# EAGLE design tiny412 (EAGLE 7.1.0)
DATABASE: ./../../../EAGLE/PARTSDB.TXT
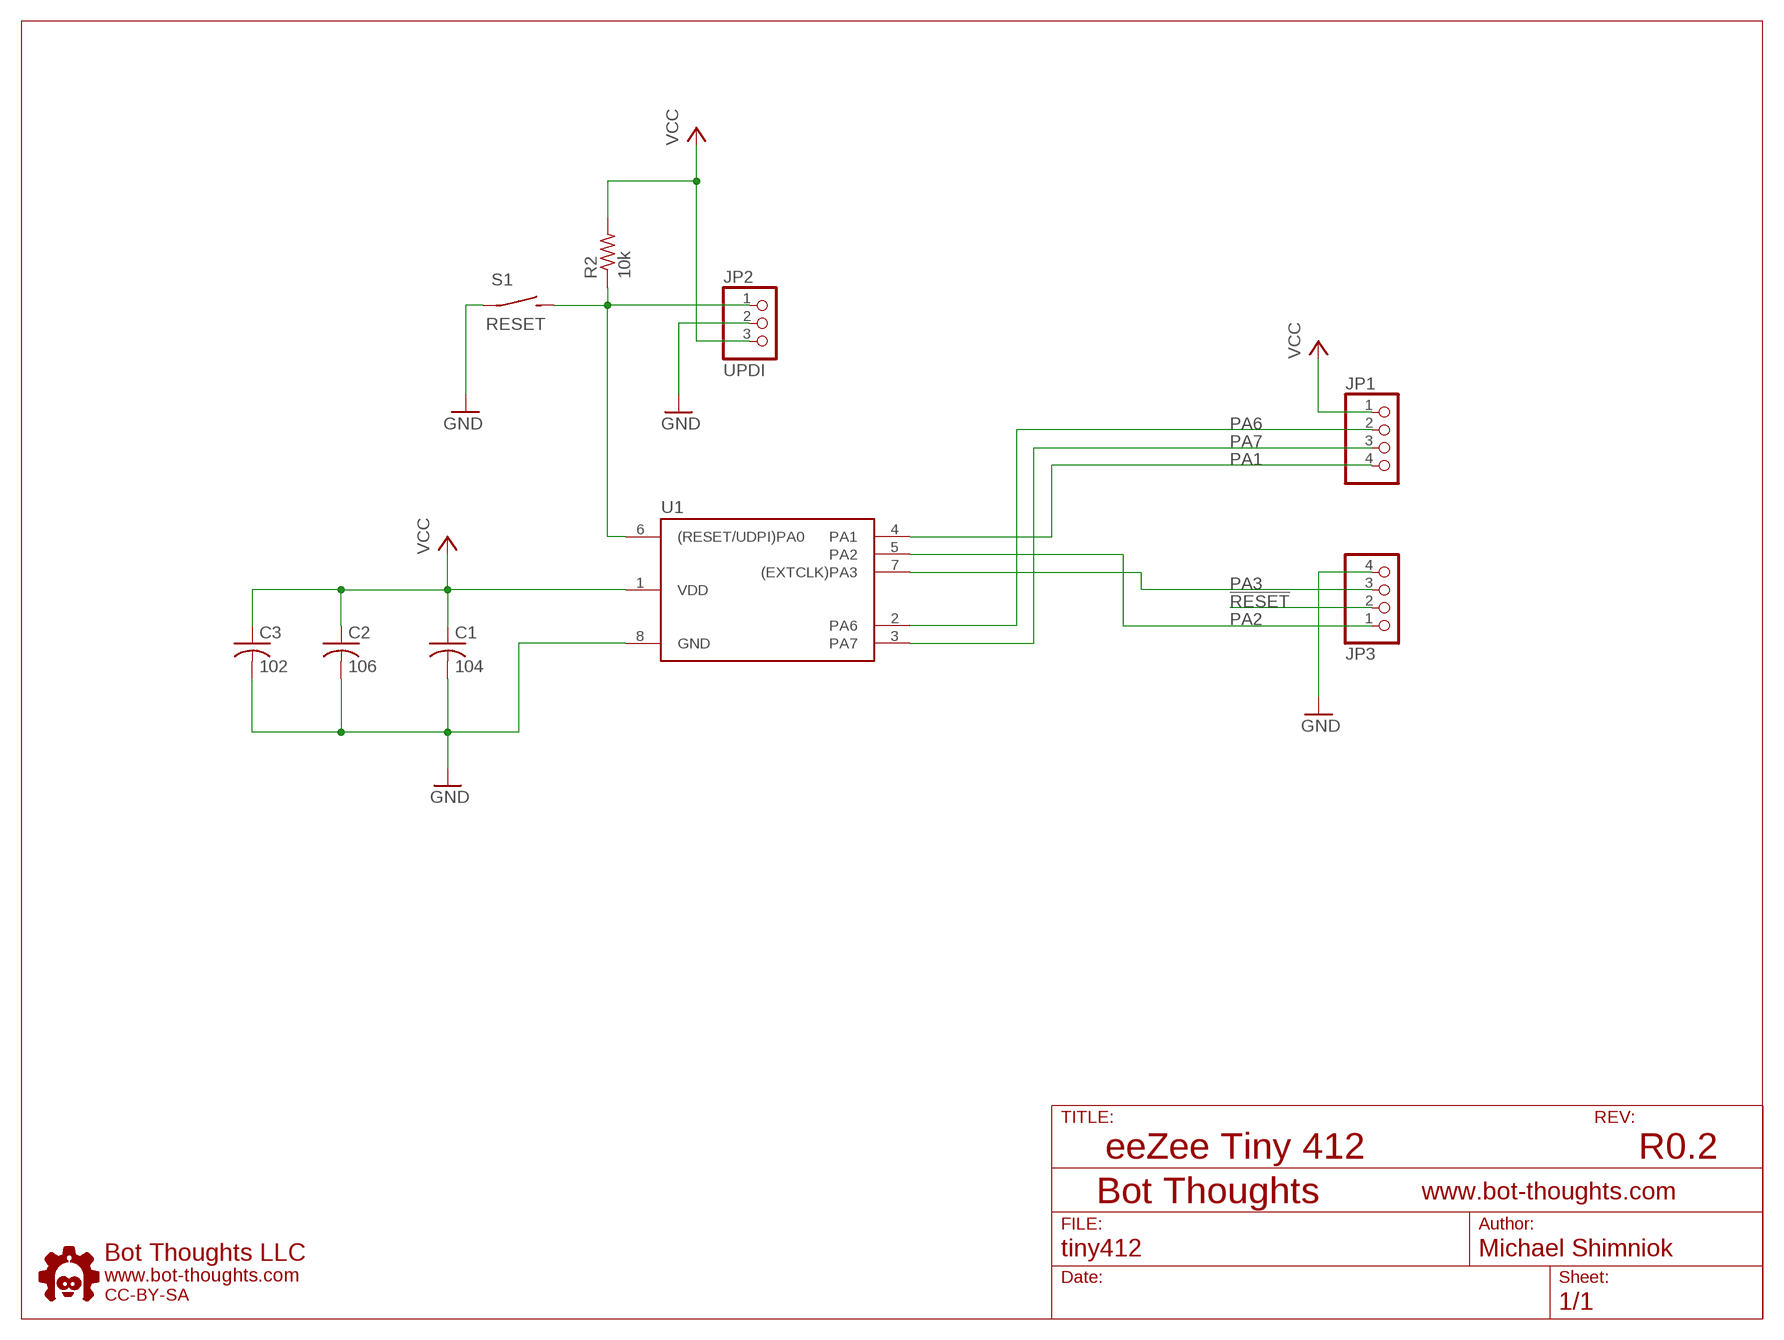
[diagram p0: schematic, sheet 1]

## Parts
C1  104  C-USC0603  [C0603]
C2  106  C-0603  [0603]
C3  102  C-USC0603  [C0603]
JP1  PINHD-1X04_2.54-S  [1X04-S]
JP2  UPDI  PINHD-1X03_2.54-S  [1X03-S]
JP3  PINHD-1X04_2.54-S  [1X04-S]
R2  10k  R-US_R0603  [R0603]
S1  RESET  SPST_3X4X2  [3X4X2TACT]
U1  ATTINY212/412  [SOIC8N]
U$1  BTLOGO-LOGO-MD  [BTLOGOM]

## Nets
!RESET: JP2.1 JP3.2 R2.1 S1.P$2(S) U1.6((RESET/UDPI)PA0)
GND: C1.2 C2.2(-) C3.2 JP2.2 JP3.4 S1.P$1(P) U1.8(GND)
PA1: JP1.4 U1.4(PA1)
PA2: JP3.1 U1.5(PA2)
PA3: JP3.3 U1.7((EXTCLK)PA3)
PA6: JP1.2 U1.2(PA6)
PA7: JP1.3 U1.3(PA7)
VCC: C1.1 C2.1(+) C3.1 JP1.1 JP2.3 R2.2 U1.1(VDD)

## Notes on the sheet
- eeZee Tiny 412 | R0.2

## Library data of the parts
C1 C3 = rcl:C-US: CAPACITOR, American symbol; BOM: EXCLUDE; PARTNO: 0603YC104KAT2A
C2 = bt_rcl:C: Capacitor, non-polarized, American symbol; BOM: EXCLUDE; PARTNO: MCTT21X106M6R3CT
JP1 JP3 = pinhead-2:PINHD-1X04: PIN HEADER
JP2 = pinhead-2:PINHD-1X03: PIN HEADER
R2 = rcl:R-US_: RESISTOR, American symbol; PARTNO: ERJ-3GEYJ103V
S1 = bt_electromech:SPST: SPST SWITCH
U1 = bt_avr:ATTINY212/412: ATtiny412/212 The ATtiny212/412 are members of the tinyAVR ® 1-series of microcontrollers, using the AVR ® processor with hardware multiplier, running at up to 20 MHz, with 2/4 KB Flash, 128/256 bytes of SRAM, and 64/128 bytes of EEPROM in an 8-pin package. The tinyAVR ® 1-series uses the latest technologies with a flexible, low-power architecture including Event System and SleepWalking, accurate analog features, and Core Independent Peripherals. ATtiny212-412-DataSheet.pdf <https://ww1.microchip.com/downloads/en/DeviceDoc/ATtiny212-412-DataSheet-DS40001911B.pdf>
U$1 = bt:BTLOGO: Bot Thoughts Logo

## Board
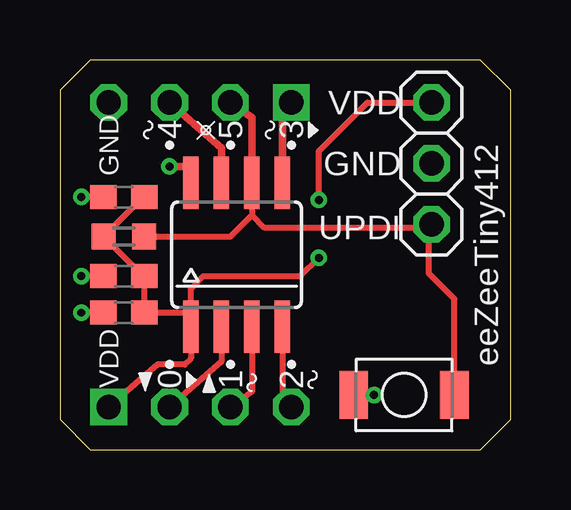
[diagram p1: board, top side]
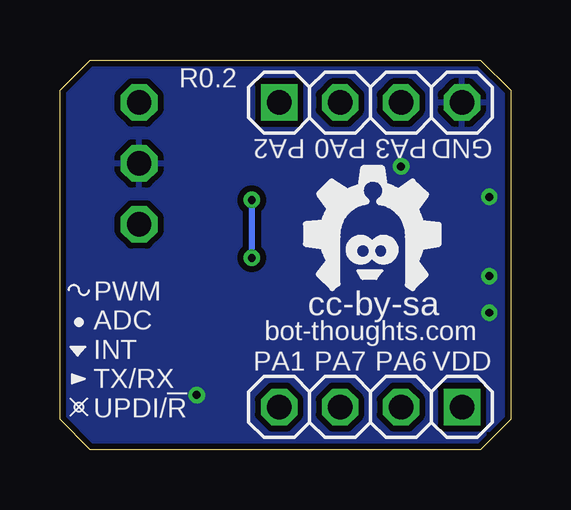
[diagram p2: board, bottom side, seen from below]

Size 18.8 x 16.26 mm. Coordinates in mm from the lower left corner, seen from the top.
Outline: 0,14.99 0,1.27 1.27,0 17.53,0 18.8,1.27 18.8,14.99 17.53,16.26 1.27,16.26 0,14.99
Copper layers (1*16): Top 0.0356mm / dielectric 1.5011mm / Bottom 0.0356mm
Design rules "LaenPCBOrder *": minimum track width 6mil, minimum drill 13mil, track to track 10mil, track to pad 10mil, pad to pad 10mil, via to via 10mil, smd to smd 8mil, copper to edge 10mil, drill to drill 10mil, minimum pad ring 7mil, minimum via ring 7mil, stop-mask expansion 3mil, vias tented up to drill 20mil, thermal gap 10mil

### Footprints (pad centres in the part's own frame; a part is rotated, then mirrored left to right if it is on the bottom)
C0603 = smd 1.1 x 1: 1 -0.85,0; 2 0.85,0
0603 = smd 1.1 x 1: 1 -0.85,0; 2 0.85,0
1X04-S = drill 1.016 square: 1 -3.81,0 | drill 1.016 octagon: 2 -1.27,0; 3 1.27,0; 4 3.81,0
1X03-S = drill 1.016 octagon: 1 -2.54,0; 2 0,0; 3 2.54,0
R0603 = smd 1 x 1.1: 1 -0.85,0; 2 0.85,0
3X4X2TACT = smd 1.2 x 2: P$1 -2.1,0; P$2 2.1,0
SOIC8N = smd 0.66 x 2.2: 1 -1.905,-3; 2 -0.635,-3; 3 0.635,-3; 4 1.905,-3; 5 1.905,3; 6 0.635,3; 7 -0.635,3; 8 -1.905,3

### Placement (x,y rotation side)
C1  2.67,5.71 180 top
C2  2.67,10.54 180 top
C3  2.67,7.24 180 top
JP1  5.84,1.78 180 bottom
JP2  15.49,11.94 90 top
JP3  5.84,14.48 0 bottom
R2  2.67,8.89 180 top
S1  14.35,2.29 0 top
U1  7.37,8.13 0 top
U$1  5.84,6.48 0 bottom
U$2  [ARDUINO_PWM]  8.76,13.34 90 top
U$3  [ARDUINO_PWM]  3.68,13.34 90 top
U$4  [ARDUINO_ASYNC]  10.54,13.34 90 top
U$5  [ARDUINO_ASYNC]  5.46,2.92 90 top
U$6  [ARDUINO_PWM]  8,2.79 90 top
U$7  [ARDUINO_PWM]  10.54,2.92 90 top
U$8  [ARDUINO_TXD_RXD]  6.22,2.67 90 top
U$9  [ARDUINO_TXD_RXD]  3.56,2.92 270 top
U$10  [ARDUINO_LEGEND]  17.4,4.19 0 bottom
U$11  [ARDUINO_UDPI_RESET]  6.1,13.34 0 top
U$12  [ARDUINO_ANALOG]  9.65,3.56 0 top
U$13  [ARDUINO_ANALOG]  7.11,3.56 0 top
U$14  [ARDUINO_ANALOG]  4.57,3.56 0 top
U$15  [ARDUINO_ANALOG]  4.57,12.7 0 top
U$16  [ARDUINO_ANALOG]  7.11,12.7 0 top
U$17  [ARDUINO_ANALOG]  9.65,12.7 0 top

### Tracks (layer width: path | path; a pad name or v marks a point on that pad's centre or on a via)
!RESET
  Top 0.254: U1.6 8,9.78 | 8,9.78 8.51,9.27 15.37,9.27 | 15.37,9.27 JP2.1 | 15.37,9.27 15.37,7.37 16.45,6.28 S1.P$2 | R2.1 7.11,8.89 8,9.78
  Top 0.305: U1.6 8,13.84 JP3.2
GND  (via drill 0.33)
  Top 0.254: S1.P$1 v13.1,2.29 | C1.2 v0.89,5.71 | C3.2 v0.89,7.24 | C2.2 v0.89,10.54
  Top 0.305: U1.8 5.46,11.68 5.33,11.81 v4.57,11.81
  pour Bottom: 0,16.26 18.8,16.26 18.8,0 0,0
PA1
  Top 0.254: U1.4 9.27,1.91 JP1.4
PA2
  Top 0.305: U1.5 9.27,14.35 JP3.1
PA3
  Top 0.305: U1.7 6.73,12.57 JP3.3
PA6
  Top 0.254: U1.2 6.73,3.68 JP1.2
PA7
  Top 0.254: U1.3 8,2.41 JP1.3
VCC  (via drill 0.33)
  Top 0.254: U1.1 5.46,3.81 5.21,3.56 4.06,3.56 JP1.1 | C2.1 3.47,10.54 R2.2 3.47,7.24 C3.1 C1.1 5.33,5.71 5.33,5.25 U1.1 | U1.1 5.46,6.73 5.97,7.24 10.03,7.24 v10.79,8 | v10.79,10.41 10.79,12.45 12.83,14.48 JP2.3
  Bottom 0.254: v10.79,8 v10.79,10.41

### Text on the board
tNames: VDD | GND | 4 | 5 | 3 | GND | eeZeeTiny412 | VDD | 0 | 1 | 2
bNames: R0.2 | GND | PA3 | PA0 | PA2 | cc-by-sa | bot-thoughts.com | VDD | PA6 | PA7 | PA1
tsilk: PA0 | PA1 | PA2 | PA3 | PA4 | PA5 | GND | Rev 0.1A | ATtiny841 | reset | VCC | eeZeeTiny841 | PB0 | PB1 | PB3 | PB2 | PA7 | PA6
bsilk: bot-thoughts.com